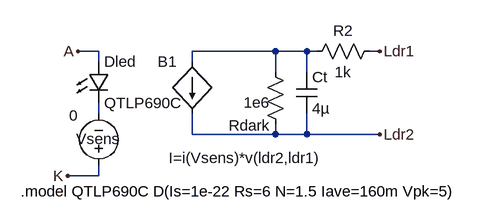
[diagram p0: schematic Led_Ldr.asc]
Led_Ldr.asc, the LTspice schematic file:
Version 4
SHEET 1 880 680
WIRE 144 96 112 96
WIRE 416 96 288 96
WIRE 464 96 416 96
WIRE 480 96 464 96
WIRE 576 96 560 96
WIRE 144 112 144 96
WIRE 288 112 288 96
WIRE 416 128 416 96
WIRE 464 128 464 96
WIRE 144 192 144 176
WIRE 288 224 288 192
WIRE 416 224 416 208
WIRE 416 224 288 224
WIRE 464 224 464 192
WIRE 464 224 416 224
WIRE 576 224 464 224
WIRE 144 288 144 272
WIRE 144 288 96 288
FLAG 112 96 A
FLAG 96 288 K
FLAG 576 96 Ldr1
FLAG 576 224 Ldr2
SYMBOL LED 128 112 R0
SYMATTR InstName Dled
SYMATTR Value QTLP690C
SYMBOL bi 288 112 M0
WINDOW 3 -198 148 Left 0
SYMATTR Value I=i(Vsens)*v(ldr2,ldr1)
SYMATTR InstName B1
SYMBOL voltage 144 288 R180
WINDOW 0 -32 57 Left 0
WINDOW 3 32 93 Left 0
SYMATTR InstName Vsens
SYMATTR Value 0
SYMBOL res 400 112 R0
WINDOW 0 -56 98 Left 0
WINDOW 3 -33 63 Left 0
SYMATTR InstName Rdark
SYMATTR Value 1e6
SYMBOL cap 448 128 R0
SYMATTR InstName Ct
SYMATTR Value 4µ
SYMBOL res 576 80 R90
WINDOW 0 0 56 VBottom 0
WINDOW 3 32 56 VTop 0
SYMATTR InstName R2
SYMATTR Value 1k
TEXT 24 312 Left 0 !.model QTLP690C D(Is=1e-22 Rs=6 N=1.5 Iave=160m Vpk=5)

The netlist it stands for:
* Led_Ldr.asc
Dled A N002 QTLP690C
B1 N001 Ldr2 I=i(Vsens)*v(ldr2,ldr1)
Vsens K N002 0
Rdark N001 Ldr2 1e6
Ct N001 Ldr2 4µ
R2 Ldr1 N001 1k
.model D D
.lib standard.dio
.model QTLP690C D(Is=1e-22 Rs=6 N=1.5 Iave=160m Vpk=5)
.backanno
.end